# Altium project EP4_ECD_On_Board_Comptuer.PrjPcb (part 1 of 2)
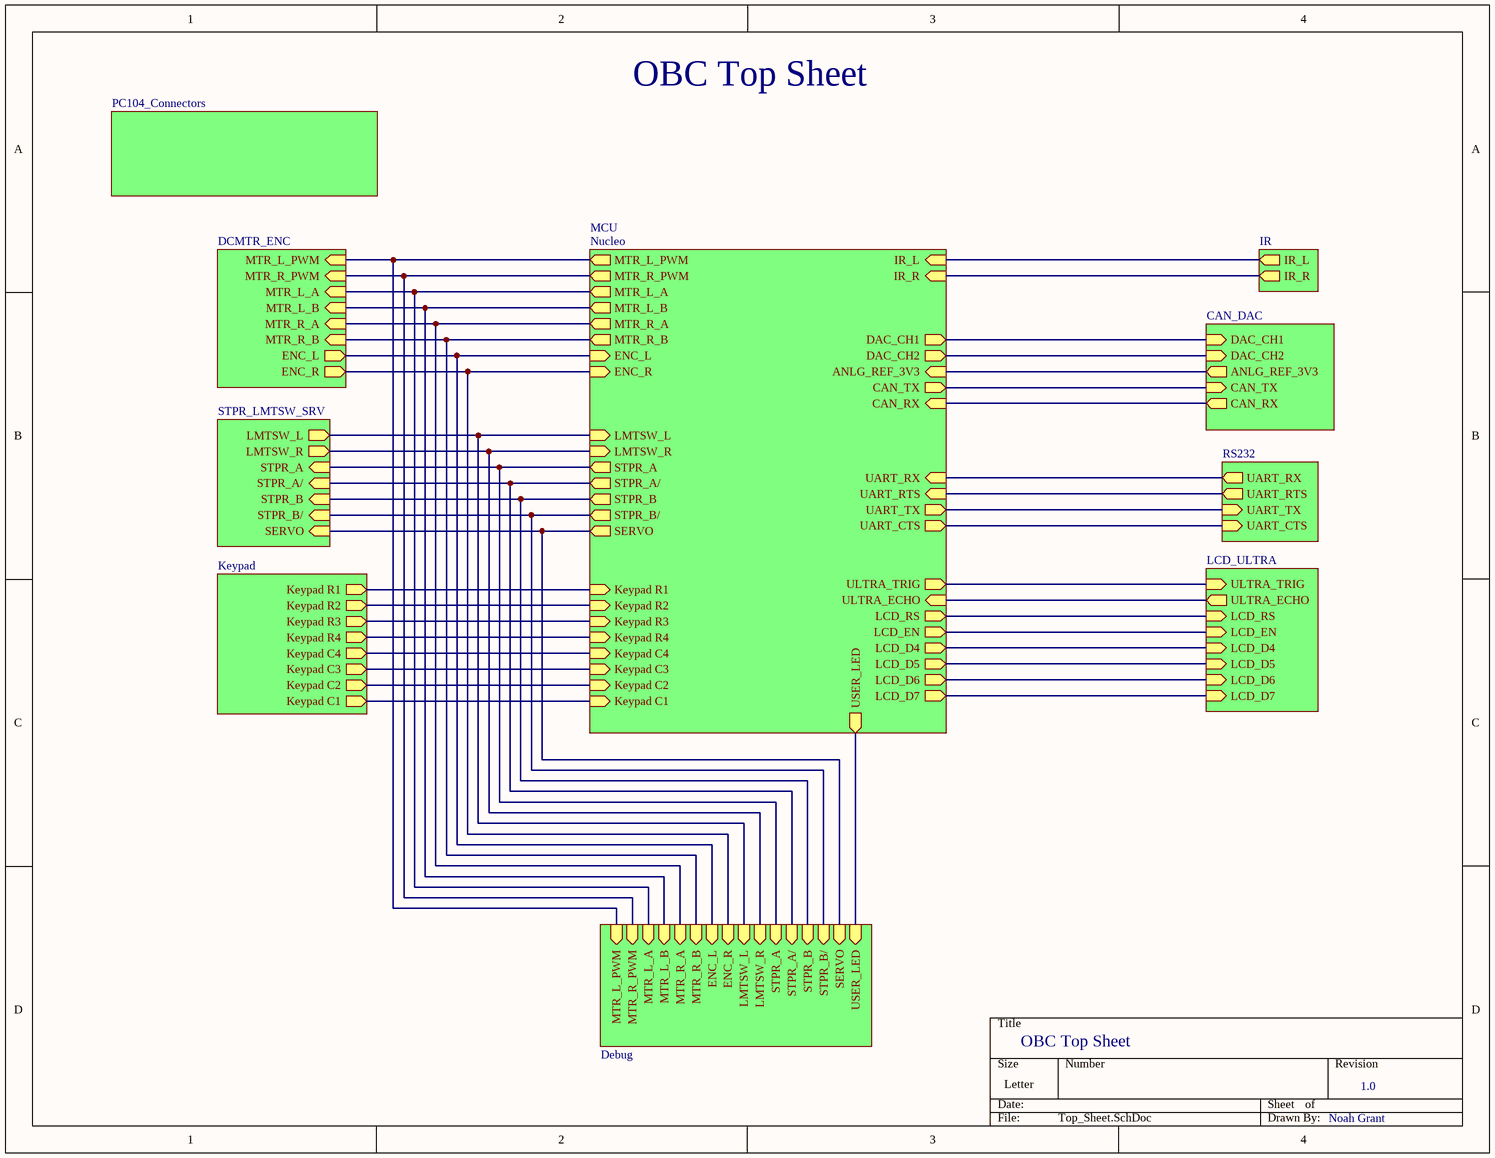
[diagram p0: Top_Sheet.SchDoc]
11 sheets, 91 parts. Net scope: hierarchical (ports join the sheet entries above them; power ports are global).
Board file: OBC.PcbDoc
Sheets:
  Top_Sheet.SchDoc
    MCU = Nucleo.SchDoc
    Designator = DCMTR_ENC.SchDoc
    Designator = STPR_LMTSW_SRV.SchDoc
    Designator = RS232.SchDoc
    Designator = CAN_DAC.SchDoc
    Designator = IR.SchDoc
    Designator = LCD_ULTRA.SchDoc
    Designator = Debug.SchDoc
    Designator = PC104_Connectors.SchDoc
    Designator = Keypad.SchDoc

## Sheet Top_Sheet.SchDoc
size Letter; SheetNumber: 1; SheetTotal: 11

### Sub-sheets
Designator = DCMTR_ENC: MTR_L_PWM (in), MTR_R_PWM (in), MTR_L_A (in), MTR_L_B (in), MTR_R_A (in), MTR_R_B (in), ENC_L (out), ENC_R (out)
Designator = STPR_LMTSW_SRV: LMTSW_L (out), LMTSW_R (out), STPR_A (in), STPR_A/ (in), STPR_B (in), STPR_B/ (in), SERVO (in)
Designator = RS232: UART_RX (out), UART_RTS (out), UART_TX (in), UART_CTS (in)
Designator = CAN_DAC: DAC_CH1 (in), DAC_CH2 (in), ANLG_REF_3V3 (out), CAN_TX (in), CAN_RX (out)
Designator = IR: IR_L (out), IR_R (out)
Designator = LCD_ULTRA: ULTRA_TRIG (in), ULTRA_ECHO (out), LCD_RS (in), LCD_EN (in), LCD_D4 (in), LCD_D5 (in), LCD_D6 (in), LCD_D7 (in)
Designator = Debug: ENC_L (in), ENC_R (in), MTR_L_PWM (in), MTR_R_PWM (in), MTR_L_A (in), MTR_L_B (in), MTR_R_A (in), MTR_R_B (in), STPR_A (in), STPR_A/ (in), STPR_B (in), STPR_B/ (in), SERVO (in), LMTSW_L (in), LMTSW_R (in), USER_LED (in)
Designator = PC104_Connectors: no entries
Designator = Keypad: Keypad R1 (out), Keypad R2 (out), Keypad R3 (out), Keypad R4 (out), Keypad C4 (out), Keypad C3 (out), Keypad C2 (out), Keypad C1 (out)
MCU = Nucleo: MTR_L_PWM (out), MTR_L_A (out), USER_LED (out), MTR_L_B (out), STPR_B (out), STPR_B/ (out), MTR_R_PWM (out), DAC_CH1 (out), STPR_A/ (out), STPR_A (out), MTR_R_B (out), CAN_RX (in), CAN_TX (out), ANLG_REF_3V3 (in), DAC_CH2 (out), LCD_RS (out), LCD_EN (out), ULTRA_ECHO (in), LCD_D5 (out), LCD_D4 (out), UART_TX (out), LCD_D6 (out), MTR_R_A (out), LMTSW_R (in), LMTSW_L (in), ULTRA_TRIG (out), LCD_D7 (out), UART_RX (in), SERVO (out), UART_CTS (out), UART_RTS (in), ENC_L (in), ENC_R (in), Keypad R1 (in), Keypad R2 (in), Keypad R3 (in), Keypad R4 (in), Keypad C4 (in), Keypad C3 (in), Keypad C2 (in), Keypad C1 (in), IR_L (in), IR_R (in)

### Nets
ANLG_REF_3V3: sheet MCU/ANLG_REF_3V3, sheet Designator/ANLG_REF_3V3
CAN_RX: sheet MCU/CAN_RX, sheet Designator/CAN_RX
CAN_TX: sheet MCU/CAN_TX, sheet Designator/CAN_TX
DAC_CH1: sheet MCU/DAC_CH1, sheet Designator/DAC_CH1
DAC_CH2: sheet MCU/DAC_CH2, sheet Designator/DAC_CH2
ENC_L: sheet MCU/ENC_L, sheet Designator/ENC_L, sheet Designator/ENC_L
ENC_R: sheet MCU/ENC_R, sheet Designator/ENC_R, sheet Designator/ENC_R
IR_L: sheet MCU/IR_L, sheet Designator/IR_L
IR_R: sheet MCU/IR_R, sheet Designator/IR_R
Keypad C1: sheet MCU/Keypad C1, sheet Designator/Keypad C1
Keypad C2: sheet MCU/Keypad C2, sheet Designator/Keypad C2
Keypad C3: sheet MCU/Keypad C3, sheet Designator/Keypad C3
Keypad C4: sheet MCU/Keypad C4, sheet Designator/Keypad C4
Keypad R1: sheet MCU/Keypad R1, sheet Designator/Keypad R1
Keypad R2: sheet MCU/Keypad R2, sheet Designator/Keypad R2
Keypad R3: sheet MCU/Keypad R3, sheet Designator/Keypad R3
Keypad R4: sheet MCU/Keypad R4, sheet Designator/Keypad R4
LCD_D4: sheet MCU/LCD_D4, sheet Designator/LCD_D4
LCD_D5: sheet MCU/LCD_D5, sheet Designator/LCD_D5
LCD_D6: sheet MCU/LCD_D6, sheet Designator/LCD_D6
LCD_D7: sheet MCU/LCD_D7, sheet Designator/LCD_D7
LCD_EN: sheet MCU/LCD_EN, sheet Designator/LCD_EN
LCD_RS: sheet MCU/LCD_RS, sheet Designator/LCD_RS
LMTSW_L: sheet MCU/LMTSW_L, sheet Designator/LMTSW_L, sheet Designator/LMTSW_L
LMTSW_R: sheet MCU/LMTSW_R, sheet Designator/LMTSW_R, sheet Designator/LMTSW_R
MTR_L_A: sheet MCU/MTR_L_A, sheet Designator/MTR_L_A, sheet Designator/MTR_L_A
MTR_L_B: sheet MCU/MTR_L_B, sheet Designator/MTR_L_B, sheet Designator/MTR_L_B
MTR_L_PWM: sheet MCU/MTR_L_PWM, sheet Designator/MTR_L_PWM, sheet Designator/MTR_L_PWM
MTR_R_A: sheet MCU/MTR_R_A, sheet Designator/MTR_R_A, sheet Designator/MTR_R_A
MTR_R_B: sheet MCU/MTR_R_B, sheet Designator/MTR_R_B, sheet Designator/MTR_R_B
MTR_R_PWM: sheet MCU/MTR_R_PWM, sheet Designator/MTR_R_PWM, sheet Designator/MTR_R_PWM
SERVO: sheet MCU/SERVO, sheet Designator/SERVO, sheet Designator/SERVO
STPR_A: sheet MCU/STPR_A, sheet Designator/STPR_A, sheet Designator/STPR_A
STPR_A/: sheet MCU/STPR_A/, sheet Designator/STPR_A/, sheet Designator/STPR_A/
STPR_B: sheet MCU/STPR_B, sheet Designator/STPR_B, sheet Designator/STPR_B
STPR_B/: sheet MCU/STPR_B/, sheet Designator/STPR_B/, sheet Designator/STPR_B/
UART_CTS: sheet MCU/UART_CTS, sheet Designator/UART_CTS
UART_RTS: sheet MCU/UART_RTS, sheet Designator/UART_RTS
UART_RX: sheet MCU/UART_RX, sheet Designator/UART_RX
UART_TX: sheet MCU/UART_TX, sheet Designator/UART_TX
ULTRA_ECHO: sheet MCU/ULTRA_ECHO, sheet Designator/ULTRA_ECHO
ULTRA_TRIG: sheet MCU/ULTRA_TRIG, sheet Designator/ULTRA_TRIG
USER_LED: sheet MCU/USER_LED, sheet Designator/USER_LED

### Notes on the sheet
- OBC Top Sheet
- 1.0
- Noah Grant

## Sheet Nucleo.SchDoc
size Letter; SheetNumber: 3; SheetTotal: 11
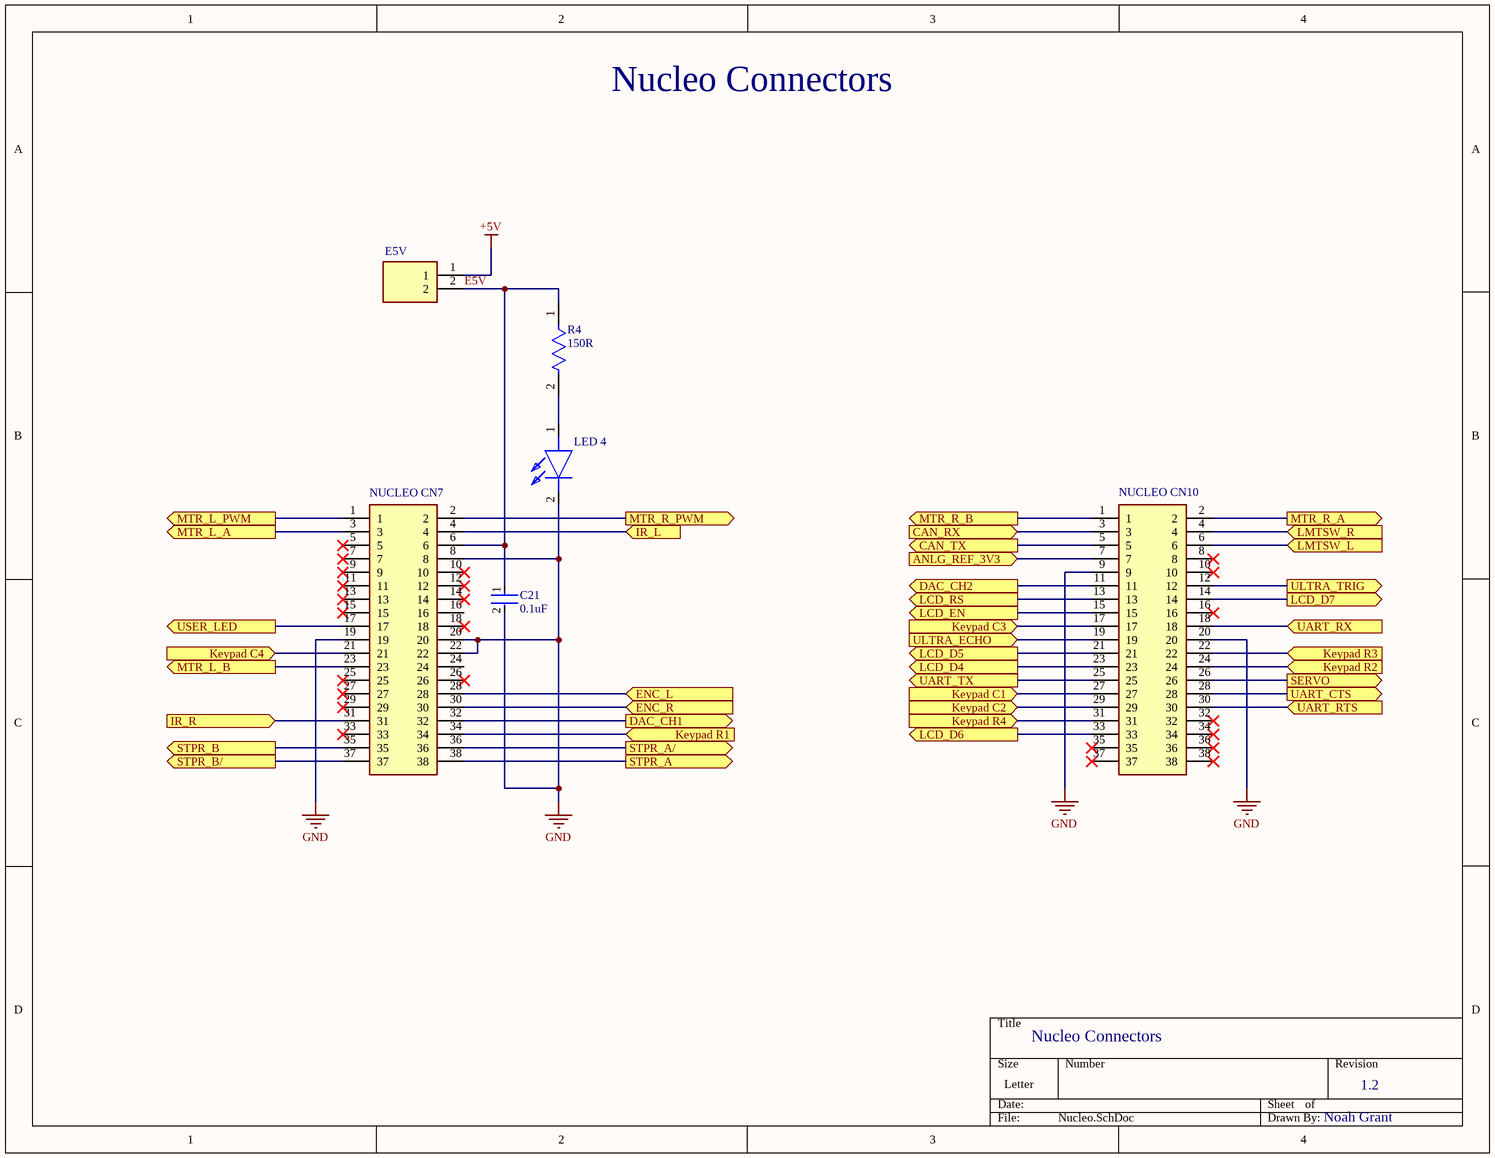
[diagram p1: Nucleo.SchDoc]

### Parts
C21  0.1uF  [FP-CC0603-DA-MFG]
E5V  0022284023  [HDRV2W87P0X254_1X2_508X249X863P]  (value not drawn)
LED_4  APL3015EC-F01  [APL3015ECF01]  (value not drawn)
NUCLEO_CN7  SSW-119-01-G-D-LL  [SSW-119-XX-YYY-D-LL]  (value not drawn)
NUCLEO_CN10  SSW-119-01-G-D-LL  [SSW-119-XX-YYY-D-LL]  (value not drawn)
R4  150R  [FP-MCT0603-IPC_C]

### Ports
ANLG_REF_3V3 (in, see Top_Sheet[3B], CAN_DAC[3D], CAN_DAC[4B]), CAN_RX (in, see Top_Sheet[3B], CAN_DAC[1B]), CAN_TX (out, see Top_Sheet[3B], CAN_DAC[1B]), DAC_CH1 (out, see Top_Sheet[3B], CAN_DAC[3B]), DAC_CH2 (out, see Top_Sheet[3B], CAN_DAC[3B]), ENC_L (in, see Top_Sheet[2B], DCMTR_ENC[2B], Debug[1B]), ENC_R (in, see Top_Sheet[2B], DCMTR_ENC[1B], Debug[1B]), IR_L (in, see Top_Sheet[3A], IR[2C]), IR_R (in, see Top_Sheet[3A], IR[4C]), Keypad C1 (in, see Top_Sheet[2C], Keypad[3B]), Keypad C2 (in, see Top_Sheet[2C], Keypad[3B]), Keypad C3 (in, see Top_Sheet[2C], Keypad[3B]), Keypad C4 (in, see Top_Sheet[2C], Keypad[3B]), Keypad R1 (in, see Top_Sheet[2C], Keypad[3C]), Keypad R2 (in, see Top_Sheet[2C], Keypad[3C]), Keypad R3 (in, see Top_Sheet[2C], Keypad[3B]), Keypad R4 (in, see Top_Sheet[2C], Keypad[3B]), LCD_D4 (out, see Top_Sheet[3C], LCD_ULTRA[1C]), LCD_D5 (out, see Top_Sheet[3C], LCD_ULTRA[1C]), LCD_D6 (out, see Top_Sheet[3C], LCD_ULTRA[1C]), LCD_D7 (out, see Top_Sheet[3C], LCD_ULTRA[1C]), LCD_EN (out, see Top_Sheet[3C], LCD_ULTRA[1B]), LCD_RS (out, see Top_Sheet[3C], LCD_ULTRA[1B]), LMTSW_L (in, see Top_Sheet[2B], Debug[3B], STPR_LMTSW_SRV[2C]), LMTSW_R (in, see Top_Sheet[2B], Debug[3B], STPR_LMTSW_SRV[2D]), MTR_L_A (out, see Top_Sheet[2A], DCMTR_ENC[3C], Debug[1B]), MTR_L_B (out, see Top_Sheet[2B], DCMTR_ENC[3C], Debug[1B]), MTR_L_PWM (out, see Top_Sheet[2A], DCMTR_ENC[3C], Debug[1B]), MTR_R_A (out, see Top_Sheet[2B], DCMTR_ENC[3C], Debug[1B]), MTR_R_B (out, see Top_Sheet[2B], DCMTR_ENC[3C], Debug[1B]), MTR_R_PWM (out, see Top_Sheet[2A], DCMTR_ENC[3C], Debug[1B]), SERVO (out, see Top_Sheet[2B], Debug[3B], STPR_LMTSW_SRV[3C]), STPR_A (out, see Top_Sheet[2B], Debug[3B], STPR_LMTSW_SRV[1B]), STPR_A/ (out, see Top_Sheet[2B], Debug[3B], STPR_LMTSW_SRV[1B]), STPR_B (out, see Top_Sheet[2B], Debug[3B], STPR_LMTSW_SRV[1B]), STPR_B/ (out, see Top_Sheet[2B], Debug[3B], STPR_LMTSW_SRV[1B]), UART_CTS (out, see Top_Sheet[3B], RS232[1B]), UART_RTS (in, see Top_Sheet[3B], RS232[3B]), UART_RX (in, see Top_Sheet[3B], RS232[3B]), UART_TX (out, see Top_Sheet[3B], RS232[1B]), ULTRA_ECHO (in, see Top_Sheet[3C], LCD_ULTRA[4B]), ULTRA_TRIG (out, see Top_Sheet[3C], LCD_ULTRA[3B]), USER_LED (out, see Top_Sheet[3C], Debug[1C])

### Nets
+5V: E5V.1
GND: C21.2 LED_4.2(K) NUCLEO_CN7.8 NUCLEO_CN7.19 NUCLEO_CN7.20 NUCLEO_CN7.22 NUCLEO_CN10.9 NUCLEO_CN10.20
ANLG_REF_3V3: NUCLEO_CN10.7 ; port ANLG_REF_3V3
CAN_RX: NUCLEO_CN10.3 ; port CAN_RX
CAN_TX: NUCLEO_CN10.5 ; port CAN_TX
DAC_CH1: NUCLEO_CN7.32 ; port DAC_CH1
DAC_CH2: NUCLEO_CN10.11 ; port DAC_CH2
E5V: C21.1 E5V.2 NUCLEO_CN7.6 R4.1
ENC_L: NUCLEO_CN7.28 ; port ENC_L
ENC_R: NUCLEO_CN7.30 ; port ENC_R
IR_L: NUCLEO_CN7.4 ; port IR_L
IR_R: NUCLEO_CN7.31 ; port IR_R
Keypad C1: NUCLEO_CN10.27 ; port Keypad C1
Keypad C2: NUCLEO_CN10.29 ; port Keypad C2
Keypad C3: NUCLEO_CN10.17 ; port Keypad C3
Keypad C4: NUCLEO_CN7.21 ; port Keypad C4
Keypad R1: NUCLEO_CN7.34 ; port Keypad R1
Keypad R2: NUCLEO_CN10.24 ; port Keypad R2
Keypad R3: NUCLEO_CN10.22 ; port Keypad R3
Keypad R4: NUCLEO_CN10.31 ; port Keypad R4
LCD_D4: NUCLEO_CN10.23 ; port LCD_D4
LCD_D5: NUCLEO_CN10.21 ; port LCD_D5
LCD_D6: NUCLEO_CN10.33 ; port LCD_D6
LCD_D7: NUCLEO_CN10.14 ; port LCD_D7
LCD_EN: NUCLEO_CN10.15 ; port LCD_EN
LCD_RS: NUCLEO_CN10.13 ; port LCD_RS
LMTSW_L: NUCLEO_CN10.6 ; port LMTSW_L
LMTSW_R: NUCLEO_CN10.4 ; port LMTSW_R
MTR_L_A: NUCLEO_CN7.3 ; port MTR_L_A
MTR_L_B: NUCLEO_CN7.23 ; port MTR_L_B
MTR_L_PWM: NUCLEO_CN7.1 ; port MTR_L_PWM
MTR_R_A: NUCLEO_CN10.2 ; port MTR_R_A
MTR_R_B: NUCLEO_CN10.1 ; port MTR_R_B
MTR_R_PWM: NUCLEO_CN7.2 ; port MTR_R_PWM
SERVO: NUCLEO_CN10.26 ; port SERVO
STPR_A: NUCLEO_CN7.38 ; port STPR_A
STPR_A/: NUCLEO_CN7.36 ; port STPR_A/
STPR_B: NUCLEO_CN7.35 ; port STPR_B
STPR_B/: NUCLEO_CN7.37 ; port STPR_B/
UART_CTS: NUCLEO_CN10.28 ; port UART_CTS
UART_RTS: NUCLEO_CN10.30 ; port UART_RTS
UART_RX: NUCLEO_CN10.18 ; port UART_RX
UART_TX: NUCLEO_CN10.25 ; port UART_TX
ULTRA_ECHO: NUCLEO_CN10.19 ; port ULTRA_ECHO
ULTRA_TRIG: NUCLEO_CN10.12 ; port ULTRA_TRIG
USER_LED: NUCLEO_CN7.17 ; port USER_LED
NetLED_4_1: LED_4.1(A) R4.2

Not connected (* = marked no-connect by the designer): NUCLEO_CN7 5* 7* 9* 10* 11* 12* 13* 14* 15* 16 18* 24 25* 26* 27* 29* 33*; NUCLEO_CN10 8* 10* 16* 32* 34* 35* 36* 37* 38*

### Notes on the sheet
- Nucleo Connectors
- 1.2
- Noah Grant

### Library data of the parts
C21 = CMP-03422-000468-1: CAP CER 0.1UF 50V X7R 0603; Manufacturer: YAGEO; Manufacturer Part Number: CC0603KPX7R9BB104; Temperature Coefficient: 15%; Capacitance: 100 nF; Material: Ceramic; Value: 100 nF; Tolerance: 0.1; Device Class L1: Passive Components; Temperature Range High: +125°C; ComponentLink2Description: Datasheet; Temperature Characteristic: X7R; Octopart: https://octopart.com/cc0603kpx7r9bb104-yageo-12885113; Height: 0.9mm; Mouser Description: Multilayer Ceramic Capacitors MLCC - SMD/SMT 100nF 50V X7R 10%; Device Class L3: Ceramic Capacitors; Voltage Rating: 50 V; Device Class L2: Capacitors; ComponentLink2URL: http://www.yageo.com/documents/recent/UPY-GPHC_X7R_6.3V-to-50V_18.pdf; Package: CC0603-DA; Automotive: No; Voltage: 50 V; RoHS: TRUE; Lead Free: Yes; Digikey Description: CAP CER 0.1UF 50V X7R 0603; Footprint Url: http://www.yageo.com/exep/pages/download/literatures/UPY-C_GEN_24.pdf; Temperature Range Low: -55°C; Temperature: -55°C to +125°C; Category: Cap
E5V = 0022284023: Connector; Manufacturer_Name: Molex; Datasheet Link: https://www.molex.com/pdm_docs/sd/022284023_sd.pdf; Height: 8.63mm; Manufacturer_Part_Number: 0022284023; Mouser Part Number: N/A; Mouser Price/Stock: https://www.mouser.co.uk/ProductDetail/Molex/0022284023?qs=PBcRNPEHKsr%2FPE%2F%252B8ije0g%3D%3D; Arrow Part Number: 0022284023; Arrow Price/Stock: https://www.arrow.com/en/products/0022284023/molex
LED_4 = APL3015EC-F01: LED; Manufacturer_Name: Kingbright; Datasheet Link: https://componentsearchengine.com/Datasheets/1/APL3015EC-F01.pdf; Manufacturer_Part_Number: APL3015EC-F01; Mouser Part Number: 604-APL3015EC-F01; Mouser Price/Stock: https://www.mouser.co.uk/ProductDetail/Kingbright/APL3015EC-F01?qs=VdjlWU%2FzoOF91deOgS6C3g%3D%3D
NUCLEO_CN7 NUCLEO_CN10 = SSW-119-01-G-D-LL: Connector; Manufacturer_Name: SAMTEC; Datasheet Link: http://suddendocs.samtec.com/prints/ssw-1xx-xx-xxx-x-xx-xxx-xx-mkt.pdf; Manufacturer_Part_Number: SSW-119-01-G-D-LL
R4 = CMP-02407-011712-1: RES SMD 100 OHM 1% 1/8W 0603; Power Rating: 125mW; Tolerance: 0.5%; Voltage Rating: 75V; Max Power Dissipation: 150mW; Temperature Coefficient: 25ppm/°C; Resistance: 150R; Packaging: Tape and Reel; Termination: SMD/SMT; Construction: Rectangular; Max Operating Temperature: 175°C; Length: 0.061inch; Case/Package: 0603; Depth: 0.85mm; Military Standard: Not; Case Code (Metric): 1608; Package Quantity: 1; Width: 0.8mm; Features: Automotive AEC-Q200; Height: 0.022inch; REACH SVHC: No SVHC; Min Operating Temperature: -55°C; Resistor Type: Thin Film; RoHS Compliant: Yes; Resistance Tolerance: 0.5%; Series: MCT 0603 - Professional; Voltage Rating (DC): 75V; Number of Terminations: 2; Case Code (Imperial): 0603; Number of Pins: 2

## Sheet DCMTR_ENC.SchDoc
size Letter; SheetNumber: 4; SheetTotal: 11; SPICEModelCacheWFUJGXDS: <root> / <DocumentId>WFUJGXDS</DocumentId> / </root>
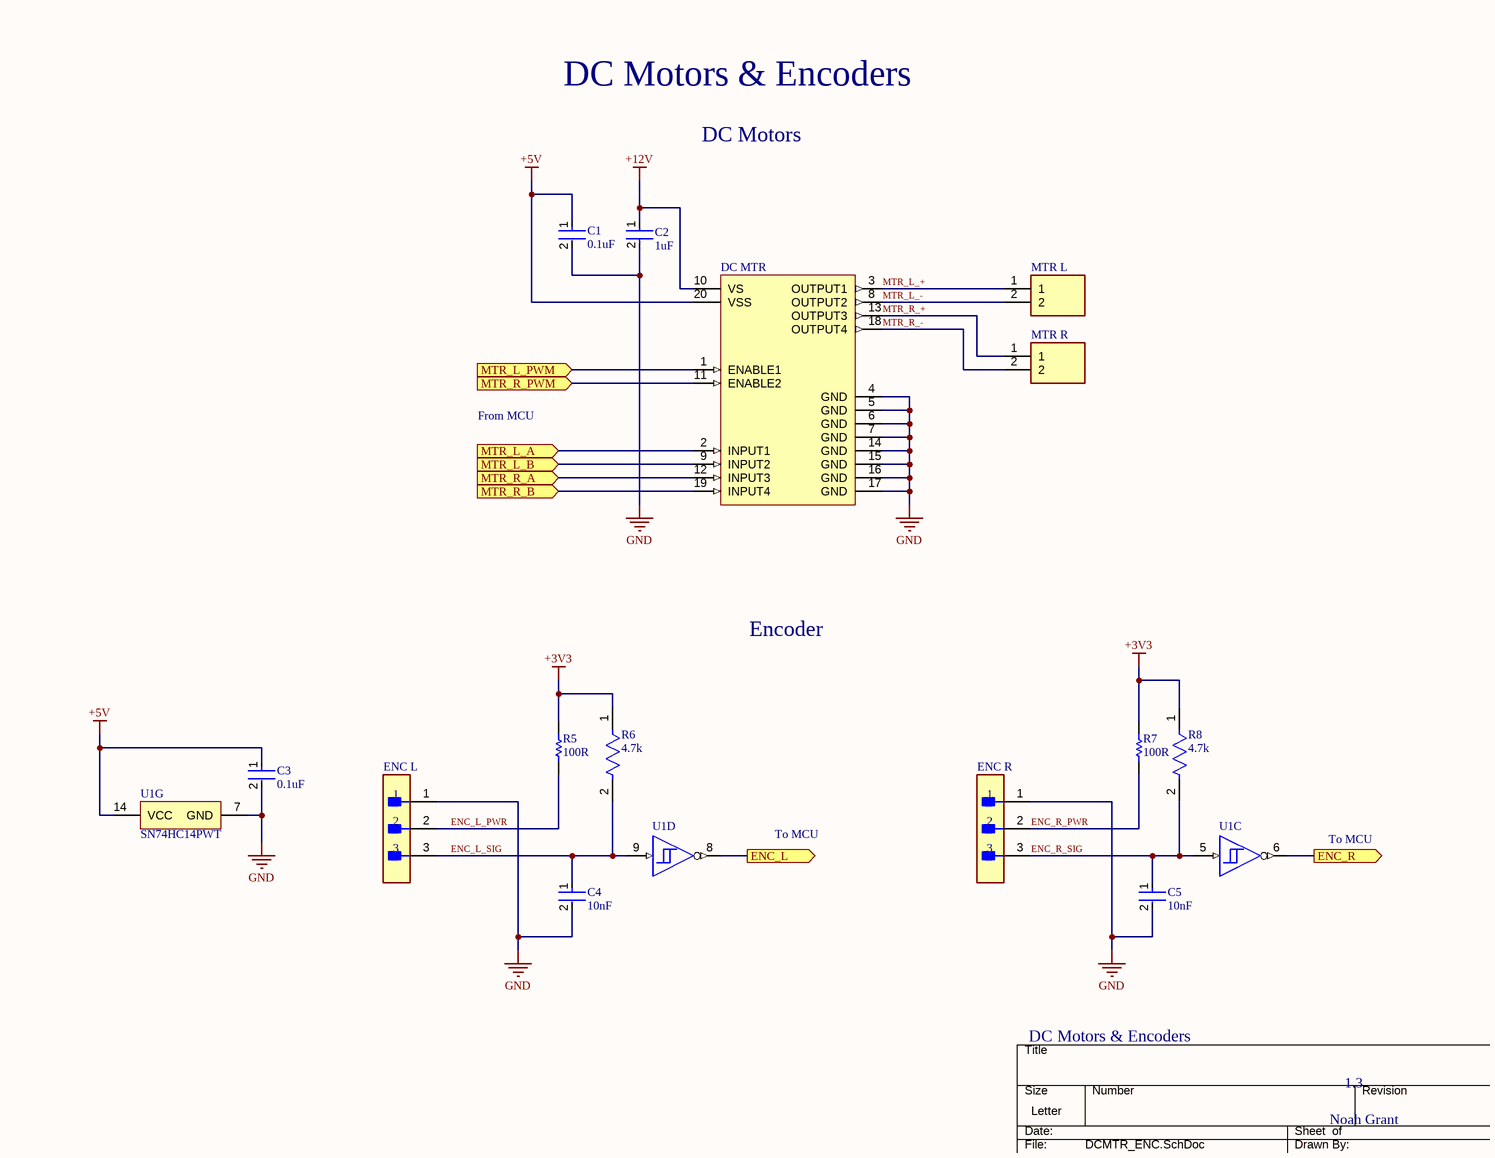
[diagram p2: DCMTR_ENC.SchDoc]

### Parts
C1  0.1uF  [FP-CC0603-DA-MFG]
C2  1uF  [FP-C1608-080-0_1-MFG]
C3  0.1uF  [FP-CC0603-DA-MFG]
C4  10nF  [FP-CC0603-DA-MFG]
C5  10nF  [FP-CC0603-DA-MFG]
DC_MTR  L293DD  [STM-SOIC-20_M]  (value not drawn)
ENC_L  22-11-2032  [FP-22-11-2032-MFG]  (value not drawn)
ENC_R  22-11-2032  [FP-22-11-2032-MFG]  (value not drawn)
MTR_L  22-11-2022  [HDRV2W75P0X254_1X2_493X635X1091P]  (value not drawn)
MTR_R  22-11-2022  [HDRV2W75P0X254_1X2_493X635X1091P]  (value not drawn)
R5  100R  [RESC1609X50X30ML8T20]
R6  4.7k  [FP-CRCW0603-e3-IPC_A]
R7  100R  [RESC1609X50X30ML8T20]
R8  4.7k  [FP-CRCW0603-e3-IPC_A]
U1  SN74HC14PWT  [PW0014A_M]  (value not drawn)  (parts C,D,G of 7)

### Ports
ENC_L (out, see Top_Sheet[1B], Debug[1B], Nucleo[2C]), ENC_R (out, see Top_Sheet[1B], Debug[1B], Nucleo[2C]), MTR_L_A (in, see Top_Sheet[1A], Debug[1B], Nucleo[1B]), MTR_L_B (in, see Top_Sheet[1B], Debug[1B], Nucleo[1C]), MTR_L_PWM (in, see Top_Sheet[1A], Debug[1B], Nucleo[1B]), MTR_R_A (in, see Top_Sheet[1B], Debug[1B], Nucleo[4B]), MTR_R_B (in, see Top_Sheet[1B], Debug[1B], Nucleo[3B]), MTR_R_PWM (in, see Top_Sheet[1A], Debug[1B], Nucleo[2B])

### Nets
+3V3: R5.2 R6.1 R7.2 R8.1
+5V: C1.1 C3.1 DC_MTR.20(VSS) U1.14(VCC)
+12V: C2.1 DC_MTR.10(VS)
GND: C1.2 C2.2 C3.2 C4.2 C5.2 DC_MTR.4(GND) DC_MTR.5(GND) DC_MTR.6(GND) DC_MTR.7(GND) DC_MTR.14(GND) DC_MTR.15(GND) DC_MTR.16(GND) DC_MTR.17(GND) ENC_L.1 ENC_R.1 U1.7(GND)
ENC_L: U1.8(~{4Y}) ; port ENC_L
ENC_L_PWR: ENC_L.2 R5.1
ENC_L_SIG: C4.1 ENC_L.3 R6.2 U1.9(4A)
ENC_R: U1.6(~{3Y}) ; port ENC_R
ENC_R_PWR: ENC_R.2 R7.1
ENC_R_SIG: C5.1 ENC_R.3 R8.2 U1.5(3A)
MTR_L_+: DC_MTR.3(OUTPUT1) MTR_L.1
MTR_L_-: DC_MTR.8(OUTPUT2) MTR_L.2
MTR_L_A: DC_MTR.2(INPUT1) ; port MTR_L_A
MTR_L_B: DC_MTR.9(INPUT2) ; port MTR_L_B
MTR_L_PWM: DC_MTR.1(ENABLE1) ; port MTR_L_PWM
MTR_R_+: DC_MTR.13(OUTPUT3) MTR_R.1
MTR_R_-: DC_MTR.18(OUTPUT4) MTR_R.2
MTR_R_A: DC_MTR.12(INPUT3) ; port MTR_R_A
MTR_R_B: DC_MTR.19(INPUT4) ; port MTR_R_B
MTR_R_PWM: DC_MTR.11(ENABLE2) ; port MTR_R_PWM

### Notes on the sheet
- DC Motors & Encoders
- DC Motors
- From MCU
- Encoder
- To MCU
- 1.3
- Noah Grant
- DWG. NO.
- REV.
- SHT.
- THIS DOCUMENT AND THE DATA DISCLOSED HEREIN OR HEREWITH IS THE PROPERTY OF ALTIUM LIMITED AND MAY BE FREELY DISTRIBUTED IN WHOLE. NO RIGHTS ARE RESERVED OR EXPRESS OR IMPLIED WARANTEE GIVEN.
- REVISION
- DESCRIPTION
- DATE
- APPROVED
- ENG:
- APPROVALS
- PROJECT
- DSN:
- CHK:
- REFERENCE DOCUMENTS
- PROJECT REVISION:
- TITLE
- DOCUMENT REVISION:
- DESIGN ITEM:
- BOM:
- FAB DWG:
- PCB DWG:
- ASSY DWG:
- SCALE:
- SIZE
- B
- CAGE CODE
- FILE NAME
- DWG NO.
- SHEET
- OF
- REV

### Library data of the parts
C1 C3 = CMP-03422-000468-1: as C21 on sheet Nucleo; Device Class L1: Passive Components; Temperature Range High: +125°C; ComponentLink2Description: Datasheet; Temperature Characteristic: X7R; Octopart: https://octopart.com/cc0603kpx7r9bb104-yageo-12885113; Height: 0.9mm; Mouser Description: Multilayer Ceramic Capacitors MLCC - SMD/SMT 100nF 50V X7R 10%; Device Class L3: Ceramic Capacitors; Voltage Rating: 50 V; Device Class L2: Capacitors; ComponentLink2URL: http://www.yageo.com/documents/recent/UPY-GPHC_X7R_6.3V-to-50V_18.pdf; Package: CC0603-DA; Automotive: No; Voltage: 50 V; RoHS: TRUE; Lead Free: Yes; Digikey Description: CAP CER 0.1UF 50V X7R 0603; Footprint Url: http://www.yageo.com/exep/pages/download/literatures/UPY-C_GEN_24.pdf; Temperature Range Low: -55°C; Temperature: -55°C to +125°C; Category: Cap
C2 = CMP-08246-006763-1: Multilayer Ceramic Capacitors 1μF ±10% 25V X6S SMD 0603; Dielectric: X6S; Capacitance: 1uF; Construction: Flat; Case/Package: 0603; Tolerance: 10%; Dielectric Material: Ceramic; Lead Free: Lead Free; Series: C; Case Code (Metric): 1608; Width: 0.031inch; Weight: 7.1E-05oz; Voltage Rating: 25V; Depth: 0.8mm; Packaging: Tape and Reel; Termination: SMD/SMT; Voltage Rating (DC): 25V; Mount: Surface Mount; Height: 0.8mm; Max Operating Temperature: 105°C; Min Operating Temperature: -55°C; Case Code (Imperial): 0603; Package Quantity: 4000; Length: 1.6mm; Thickness: 0.035inch; RoHS Compliant: Yes
C4 C5 = CMP-2100-03600-2: CAP CER 10000PF 50V X7R 0603; Manufacturer Part Number: CC0603KRX7R9BB103; Manufacturer: YAGEO; Tolerance: 0.1; Material: Ceramic; Temperature Coefficient: 15%; Mouser Description: Multilayer Ceramic Capacitor, CC Series, 0.01 - F, - 10%, X7R, 50 V, 0603 [1608 Metric]; Digikey Description: CAP CER 10000PF 50V X7R 0603; Height: 0.9mm; Category: Cap; Temperature Characteristic: X7R; Footprint Url: http://www.yageo.com/exep/pages/download/literatures/UPY-C_GEN_24.pdf; Lead Free: Yes; Voltage Rating: 50 V; Temperature: -55°C to +125°C; Device Class L3: Ceramic Capacitors; ComponentLink2Description: Datasheet; Voltage: 50 V; Package: CC0603-DA; Octopart: https://octopart.com/cc0603krx7r9bb103-yageo-192938; Automotive: No; Temperature Range High: +125°C; Temperature Range Low: -55°C; Value: 10 nF; RoHS: TRUE; Device Class L1: Passive Components; ComponentLink2URL: http://www.yageo.com/documents/recent/UPY-GPHC_X7R_6.3V-to-50V_18.pdf; Device Class L2: Capacitors; Capacitance: 10 nF
DC_MTR = CMP-1771-00003-1: Push-Pull Four Channel Driver with Diodes, 4.5 to 36 V, 20-Pin SOIC, RoHS, Tube; Voltage Rating: 50 V; Power Rating: 100 mW; Case\Package: 0603; Resistance: 15 kohm; Tolerance: 1%; REACH SVHC: Unknown; Case Code (Imperial): 0603; ComponentLink2Description: Datasheet; ComponentLink2URL: http://www.st.com/content/ccc/resource/technical/document/datasheet/04/ac/22/f9/20/5d/43/a1/CD00000059.pdf/files/CD00000059.pdf/jcr:content/translations/en.CD00000059.pdf; Max Operating Temperature: 155 degC; Width: 0.8 mm; ComponentLink1URL: http://www.st.com/; ComponentLink1Description: Manufacturer URL; Length: 1.6 mm; Package Quantity: 5000; RoHSCompliant: true; Height: 0.45 mm; Mount: Surface Mount; PackageDescription: 20-Pin Small Outline Integrated Circuit, Body 12.8 x 7.5 mm, Pitch 1.27 mm; PackageReference: SOIC-20; Packaging: Tape and Reel; Min Operating Temperature: -55 degC; Case Code (Metric): 1608; DatasheetVersion: Jul-03
ENC_L ENC_R = CMP-04776-000113-1: CONN HEADER VERT 3POS 2.54MM; Manufacturer: Molex; Number Of Contacts: 3; Voltage Rating: 500V; Conn Gender: Male; Current Rating: 4A; Conn Orientation: Vertical; Device Class L2: Headers and Wire Housings; Number Of Rows: 1; Temperature Range High: +80°C; RoHS: TRUE; ComponentLink2URL: https://www.molex.com/webdocs/datasheets/pdf/en-us/0022112032_PCB_HEADERS.pdf; Manufacturer Part Number: 22-11-2032; Device Class L3: unset; Automotive: No; Temperature: -40°C to +80°C; Temperature Range Low: -40°C; Lead Free: Yes; Pitch: 2.54mm; Footprint Url: https://www.molex.com/pdm_docs/sd/022112032_sd.pdf; Digikey Description: CONN HEADER VERT 3POS 2.54MM; Contact Material: Gold,Nickel; Octopart: https://octopart.com/22-11-2032-molex-10085; Height: 10.91mm; Mouser Description: KK® 254 Solid Header, Vertical, with Friction Lock, 3 Circuits, Gold (Au) Plating; Package: 22-11-2032; Device Class L1: Connectors; Mounting Type: Through Hole; ComponentLink2Description: Datasheet; Category: Conn
MTR_L MTR_R = 22-11-2022: Connector; Manufacturer_Name: Molex; Datasheet Link: https://www.molex.com/pdm_docs/sd/022112022_sd.pdf; Height: 10.91mm; Manufacturer_Part_Number: 22-11-2022
R5 R7 = CMP-2000-03824-5: Chip Resistor, 100 Ohm, +/- 1%, 100 mW,-55 to 155 degC, 0603 (1608 Metric), RoHS, Tape and Ree; Manufacturer: Vishay Semiconductor; ComponentLink2URL: http://www.vishay.com/docs/20035/dcrcwe3.pdf; ComponentLink1URL: http://www.vishay.com/; Mounting Technology: Surface Mount; ComponentLink1Description: Manufacturer URL; ComponentLink2Description: Datasheet; PackageDescription: 2-Pin Surface Mount Device, Body 1.575 x 0.85 mm; PackageReference: 0603; DatasheetVersion: 06/2012
R6 R8 = CMP-1666-00019-3: RES Thick Film, 4.7kΩ, 1%, 0.1W, 100ppm/°C, 0603; Resistance: 4.7kR; Voltage Rating: 75V; Power Rating: 100mW; Case Code (Metric): 1608; Military Standard: Not; Packaging: Tape and Reel; Termination: SMD/SMT; Temperature Coefficient: 100ppm/°C; Lead Free: Lead Free; Length: 1.55mm; Width: 0.85mm; Height: 0.45mm; Depth: 0.85mm; Weight: 7.1E-05oz; Case Code (Imperial): 0603; Contact Plating: Tin; Case/Package: 0603; Max Operating Temperature: 155°C; Mount: Surface Mount; Tolerance: 1%; Min Operating Temperature: -55°C; Package Quantity: 5000; Voltage Rating (DC): 75V; Composition: Thick Film
U1 = CMP-1615-00108-4: Hex Schmitt-Trigger Inverters, PW0014A, SMALL T&R; Manufacturer: Texas Instruments; F @ Nom Voltage(Max)(Mhz): 20; Input Type: CMOS; VCC(Min)(V): 2; Bits(#): 6; Output Drive (IOL/IOH)(Max)(mA): -4/4; Technology Family: HC; Rating: Catalog; Voltage(Nom)(V): 5; ICC @ Nom Voltage(Max)(mA): 0.02; Schmitt Trigger: Yes; tpd @ Nom Voltage(Max)(ns): 31; Operating Temperature Range(C): -40 to 85; Output Type: CMOS; DatasheetVersion: SCLS085G; Generic Part Number: SN74HC14; VCC(Max)(V): 6; Code_JEDEC: MO-153; PackageReference: PW0014A

## Sheet STPR_LMTSW_SRV.SchDoc
size Letter; SheetNumber: 5; SheetTotal: 11; SPICEModelCacheESSCVQFR: <root> / <DocumentId>ESSCVQFR</DocumentId> / <CacheFrame Number="0"> / <Model Name="umk107bj105_a-t" Kind="CKT"> / <Text>* UMK107BJ105_A-T     SPICE MODEL  ( General Type ) / *-------------------------------------------------------------------------------------------------------- / * Model Generated by TAIYO YUDEN Corporation (http://www.ty-top.com) / * Version 1.0 / * TAIYO YUDEN Control No. 170508_130520 / * Copyright(c) 2012 TAIYO YUDEN CO.,LTD. All Rights Reserved. / *-------------------------------------------------------------------------------------------------------- / * / * Products Name : Multilayer Ceramic Capacitors / * / * Characteristics : / *     Capacitance : 1 uF , Rated Voltage : 50V , TCC : X5R / *     Case Size : 1.6 x 0.8 / 0.063 x 0.031 [mm/inch] , Thickness : 0.8 / 0.031 [mm/inch] / *     (Conditions: Temperature = 25 degC , DC Bias Current/Voltage = 0A / 0V) / * / * Frequency Range : 40Hz - 3GHz / * / * External Node Assignments : / * / *  1  o---| |---o  2 / * / *-------------------------------------------------------------------------------------------------------- / .SubCkt UMK107BJ105_A-T 1 2 / **************************** / C0 1 110 0.79929u / Cm 1 101 0.13681u / C1 101 102 0.26224u / Rc1 101 102 5.8806k / C2 102 103 0.057839u / Rc2 102 103 469.42 / C3 103 110 0.014568u / Rc3 103 110 14.853 / C2m 1 301 0.13283u / C21 301 302 1.2593u / Rc21 301 302 6.3079k / C22 302 303 1.1189u / Rc22 302 303 6.9405k / C23 303 304 1.1421u / Rc23 303 304 6.4848k / C24 304 305 0.36861u / Rc24 304 305 785 / C25 305 306 0.39327u / Rc25 305 306 637.41 / C26 306 307 0.27451u / Rc26 306 307 19.365 / C27 307 308 0.15295u / Rc27 307 308 23.239 / C28 308 309 0.17569u / Rc28 308 309 17.788 / C29 309 110 1420.6p / Rc29 309 110 1.9725 / Rp0 1 110 500Meg / L0 110 120 0.24088n / Lm 120 130 0.1369n / L1 120 121 0.1842n / RL1 121 130 0.29804 / L2 120 122 0.40657n / RL2 122 130 0.57395 / L3 120 123 0.85773n / RL3 123 130 0.82282 / CR 120 124 0.11463u / LR 124 125 0.25983n / RR 125 130 52.447m / CL 130 140 1.4637p / LL 130 140 0.23986n / RL 130 140 33.985 / Rs 140 2 6.8539m / **************************** / .ends UMK107BJ105_A-T</Text> / </Model> / </CacheFrame> / </root>
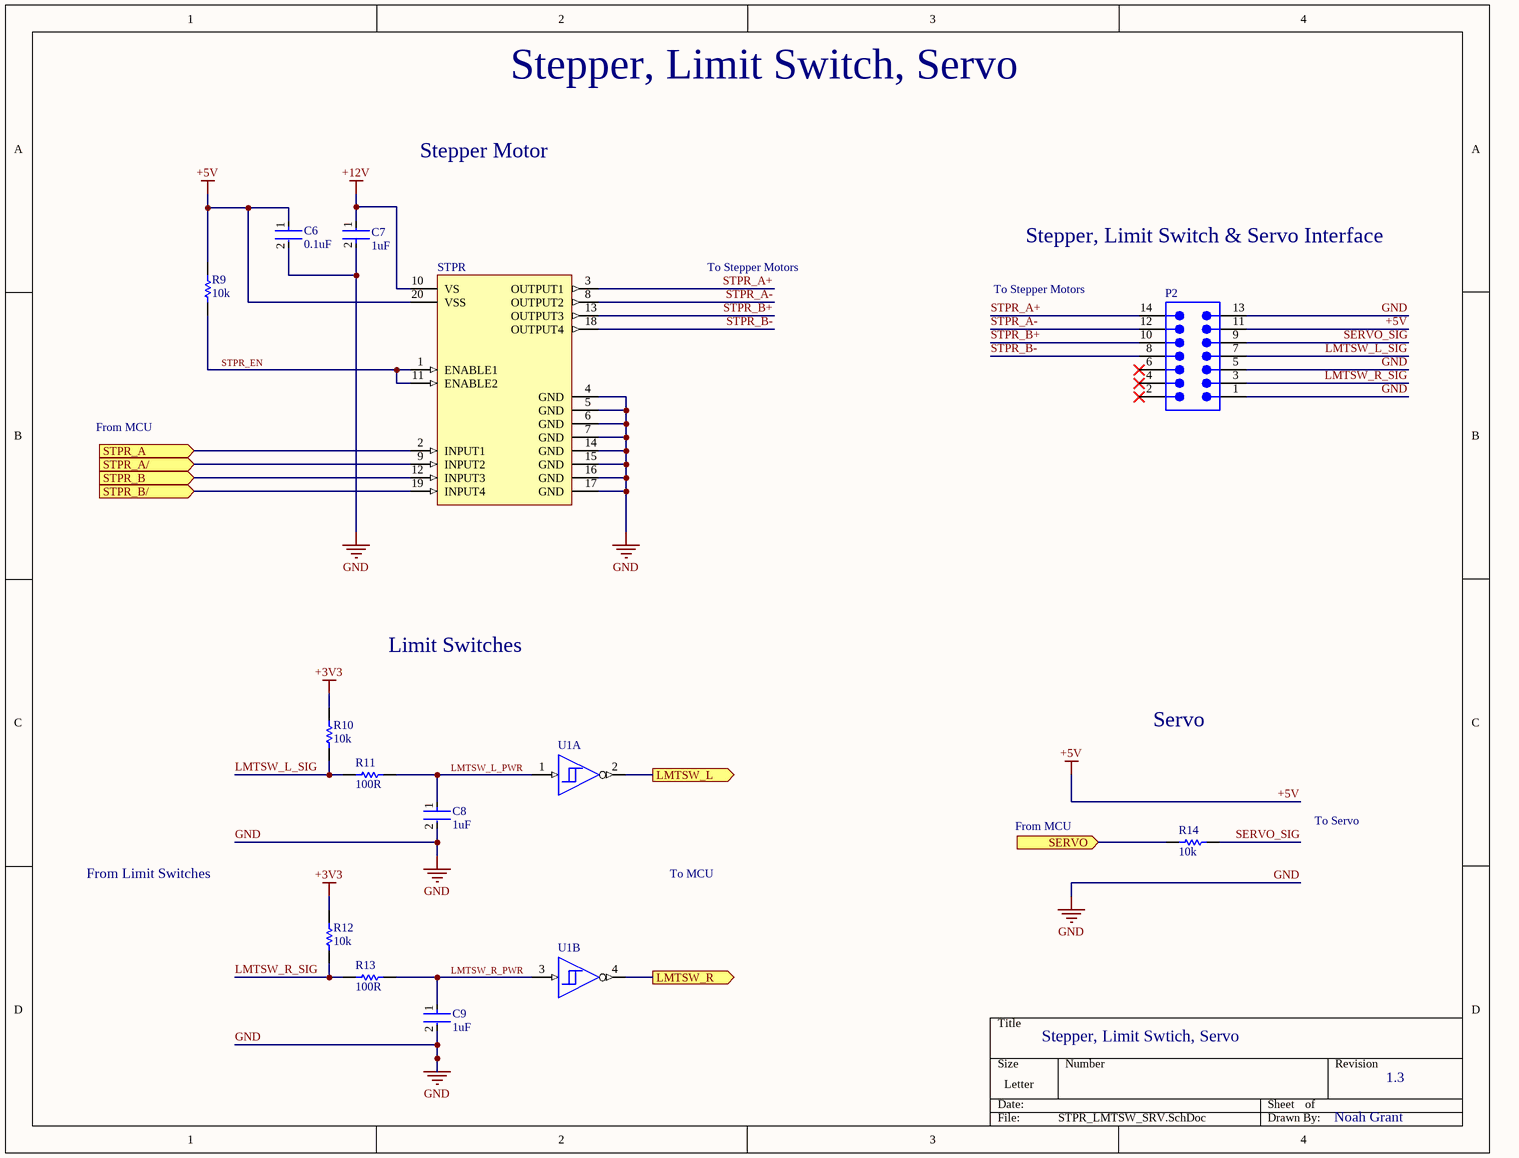
[diagram p3: STPR_LMTSW_SRV.SchDoc]

### Parts
C6  0.1uF  [FP-CC0603-DA-MFG]
C7  1uF  [FP-C1608-080-0_1-MFG]
C8  1uF  [FP-0603-L_1_6_0_1-W_0_8_0-IPC_A]
C9  1uF  [FP-0603-L_1_6_0_1-W_0_8_0-IPC_A]
P2  TSW-107-06-L-D  [SMTC-TSW-107-06-X-D]  (value not drawn)
R9  10k  [RESC1609X50X30NL8T20]
R10  10k  [RESC1609X50X30NL8T20]
R11  100R  [RESC1609X50X30ML8T20]
R12  10k  [RESC1609X50X30NL8T20]
R13  100R  [RESC1609X50X30ML8T20]
R14  10k  [RESC1609X50X30NL8T20]
STPR  L293DD  [STM-SOIC-20_M]  (value not drawn)
U1  SN74HC14PWT  [PW0014A_M]  (value not drawn)  (parts A,B of 7)

### Ports
LMTSW_L (out, see Top_Sheet[1B], Debug[3B], Nucleo[4B]), LMTSW_R (out, see Top_Sheet[1B], Debug[3B], Nucleo[4B]), SERVO (in, see Top_Sheet[1B], Debug[3B], Nucleo[4C]), STPR_A (in, see Top_Sheet[1B], Debug[3B], Nucleo[2C]), STPR_A/ (in, see Top_Sheet[1B], Debug[3B], Nucleo[2C]), STPR_B (in, see Top_Sheet[1B], Debug[3B], Nucleo[1C]), STPR_B/ (in, see Top_Sheet[1B], Debug[3B], Nucleo[1C])

### Nets
+3V3: R10.2 R12.2
+5V: C6.1 P2.11 R9.2 STPR.20(VSS)
+12V: C7.1 STPR.10(VS)
GND: C6.2 C7.2 C8.2 C9.2 P2.1 P2.5 P2.13 STPR.4(GND) STPR.5(GND) STPR.6(GND) STPR.7(GND) STPR.14(GND) STPR.15(GND) STPR.16(GND) STPR.17(GND)
LMTSW_L: U1.2(~{1Y}) ; port LMTSW_L
LMTSW_L_PWR: C8.1 R11.1 U1.1(1A)
LMTSW_L_SIG: P2.7 R10.1 R11.2
LMTSW_R: U1.4(~{2Y}) ; port LMTSW_R
LMTSW_R_PWR: C9.1 R13.1 U1.3(2A)
LMTSW_R_SIG: P2.3 R12.1 R13.2
SERVO: R14.1 ; port SERVO
SERVO_SIG: P2.9 R14.2
STPR_A: STPR.2(INPUT1) ; port STPR_A
STPR_A+: P2.14 STPR.3(OUTPUT1)
STPR_A-: P2.12 STPR.8(OUTPUT2)
STPR_A/: STPR.9(INPUT2) ; port STPR_A/
STPR_B: STPR.12(INPUT3) ; port STPR_B
STPR_B+: P2.10 STPR.13(OUTPUT3)
STPR_B-: P2.8 STPR.18(OUTPUT4)
STPR_B/: STPR.19(INPUT4) ; port STPR_B/
STPR_EN: R9.1 STPR.1(ENABLE1) STPR.11(ENABLE2)

Not connected (* = marked no-connect by the designer): P2 2* 4* 6*

### Notes on the sheet
- Stepper, Limit Switch, Servo
- Stepper Motor
- To Stepper Motors
- Stepper, Limit Switch & Servo Interface
- From MCU
- Limit Switches
- Servo
- To Servo
- From Limit Switches
- To MCU
- Stepper, Limit Swtich, Servo
- 1.3
- Noah Grant

### Library data of the parts
C6 = CMP-03422-000468-1: CAP CER 0.1UF 50V X7R 0603; Manufacturer: YAGEO; Manufacturer Part Number: CC0603KPX7R9BB104; Temperature Coefficient: 15%; Capacitance: 100 nF; Description: CC0603 100 nF X7R 10.00% 50 V; Material: Ceramic; Value: 100 nF; Tolerance: 0.1; Device Class L1: Passive Components; Temperature Range High: +125°C; ComponentLink2Description: Datasheet; Temperature Characteristic: X7R; Octopart: https://octopart.com/cc0603kpx7r9bb104-yageo-12885113; Height: 0.9mm; Mouser Description: Multilayer Ceramic Capacitors MLCC - SMD/SMT 100nF 50V X7R 10%; Device Class L3: Ceramic Capacitors; Voltage Rating: 50 V; Device Class L2: Capacitors; ComponentLink2URL: http://www.yageo.com/documents/recent/UPY-GPHC_X7R_6.3V-to-50V_18.pdf; Package: CC0603-DA; Automotive: No; Voltage: 50 V; RoHS: TRUE; Lead Free: Yes; Digikey Description: CAP CER 0.1UF 50V X7R 0603; Footprint Url: http://www.yageo.com/exep/pages/download/literatures/UPY-C_GEN_24.pdf; Temperature Range Low: -55°C; Temperature: -55°C to +125°C; Category: Cap
C7 = CMP-08246-006763-1: as C2 on sheet DCMTR_ENC; Dielectric: X6S; Capacitance: 1uF; Construction: Flat; Case/Package: 0603; Tolerance: 10%; Dielectric Material: Ceramic; Lead Free: Lead Free; Series: C; Case Code (Metric): 1608; Width: 0.031inch; Weight: 7.1E-05oz; Voltage Rating: 25V; Depth: 0.8mm; Packaging: Tape and Reel; Termination: SMD/SMT; Voltage Rating (DC): 25V; Mount: Surface Mount; Height: 0.8mm; Max Operating Temperature: 105°C; Min Operating Temperature: -55°C; Case Code (Imperial): 0603; Package Quantity: 4000; Length: 1.6mm; Thickness: 0.035inch; RoHS Compliant: Yes
C8 C9 = CMP-2000-05447-3: None; Tolerance: 10%; Voltage Rating: 50V; Dielectric: X5R; Height: 0.8mm; Depth: 0.8mm; Number of Pins: 2; Length: 1.6mm; Thickness: 0.035inch; Contact Plating: Nickel; Radiation Hardening: No; Package Quantity: 1; Case/Package: 0603; Capacitance: 1uF; Halogen Free: Halogen Free; RoHS Compliant: Yes; Termination: SMD/SMT; Max Operating Temperature: 85°C; Min Operating Temperature: -55°C; Case Code (Metric): 1608; Construction: Flat; Voltage Rating (DC): 50V; Packaging: Tape and Reel; Series: M; Case Code (Imperial): 0603; Width: 0.031inch; Mount: Surface Mount
P2 = CMP-1024-00406-1: 0.025" SQ Post Header, Through-hole, Vertical, -55 to 125 degC, 2.54 mm Pitch, 14-Pin, Male, RoHS; Manufacturer: Samtec; Pitch: 2.54 mm; RoHS: True; PackageVersion: DM, 8/1988; Mounting Technology: Through-hole; ComponentLink1Description: Manufacturer URL; Orientation: Vertical; PartNumber: TSW-107-06-L-D; Temperature Range: -55 to 125 degC; ComponentLink3URL: http://www.samtec.com/documents/webfiles/cpdf/TSW-XXX-XX-XXX-X-XX-XXX-MKT.pdf; PackageDescription: .025[0.64] SQ. Post Terminal Strip Assembly; PackageReference: TSW-107-06-X-D; ComponentLink2Description: Datasheet; ComponentLink3Description: Package Specification; ComponentLink1URL: http://www.samtec.com; DatasheetVersion: F-214; ComponentLink2URL: http://www.samtec.com/documents/webfiles/pdf/TSW_TH.PDF
R9 R10 R12 R14 = CMP-1666-00005-4: Chip Resistor, 10 KOhm, +/- 1%, 100 mW, -55 to 155 degC, 0603 (1608 Metric), RoHS, Tape and Reel; Manufacturer: Vishay Semiconductor; Voltage Rating: 75 V; Max Operating Temperature: 155 degC; PackageDescription: 2-Pin Surface Mount Device, Body 1.575 x 0.85 mm; ComponentLink1Description: Manufacturer URL; RoHSCompliant: true; PackageReference: 0603; REACH SVHC: Unknown; Length: 1.55 mm; DatasheetVersion: 06/2012; Packaging: Tape and Reel; Min Operating Temperature: -55 degC; Mounting Technology: Surface Mount; ComponentLink2URL: https://datasheet.ciiva.com/11809/0900766b80d98afc-11809037.pdf; Height: 0.45 mm; ComponentLink2Description: Datasheet; Package Quantity: 5000; ComponentLink1URL: http://www.vishay.com/
R11 R13 = CMP-2000-03824-5: as R5 on sheet DCMTR_ENC; ComponentLink2URL: http://www.vishay.com/docs/20035/dcrcwe3.pdf; ComponentLink1URL: http://www.vishay.com/; Mounting Technology: Surface Mount; ComponentLink1Description: Manufacturer URL; ComponentLink2Description: Datasheet; PackageDescription: 2-Pin Surface Mount Device, Body 1.575 x 0.85 mm; PackageReference: 0603; DatasheetVersion: 06/2012
STPR = CMP-1771-00003-1: as DC_MTR on sheet DCMTR_ENC; REACH SVHC: Unknown; Case Code (Imperial): 0603; ComponentLink2Description: Datasheet; ComponentLink2URL: http://www.st.com/content/ccc/resource/technical/document/datasheet/04/ac/22/f9/20/5d/43/a1/CD00000059.pdf/files/CD00000059.pdf/jcr:content/translations/en.CD00000059.pdf; Max Operating Temperature: 155 degC; Width: 0.8 mm; ComponentLink1URL: http://www.st.com/; ComponentLink1Description: Manufacturer URL; Length: 1.6 mm; Package Quantity: 5000; RoHSCompliant: true; Height: 0.45 mm; Mount: Surface Mount; PackageDescription: 20-Pin Small Outline Integrated Circuit, Body 12.8 x 7.5 mm, Pitch 1.27 mm; PackageReference: SOIC-20; Packaging: Tape and Reel; Min Operating Temperature: -55 degC; Case Code (Metric): 1608; DatasheetVersion: Jul-03
U1 = CMP-1615-00108-4: as U1 on sheet DCMTR_ENC; Operating Temperature Range(C): -40 to 85; Output Type: CMOS; DatasheetVersion: SCLS085G; Generic Part Number: SN74HC14; VCC(Max)(V): 6; Code_JEDEC: MO-153; PackageReference: PW0014A

## Sheet RS232.SchDoc
size Letter; SheetNumber: 6; SheetTotal: 11
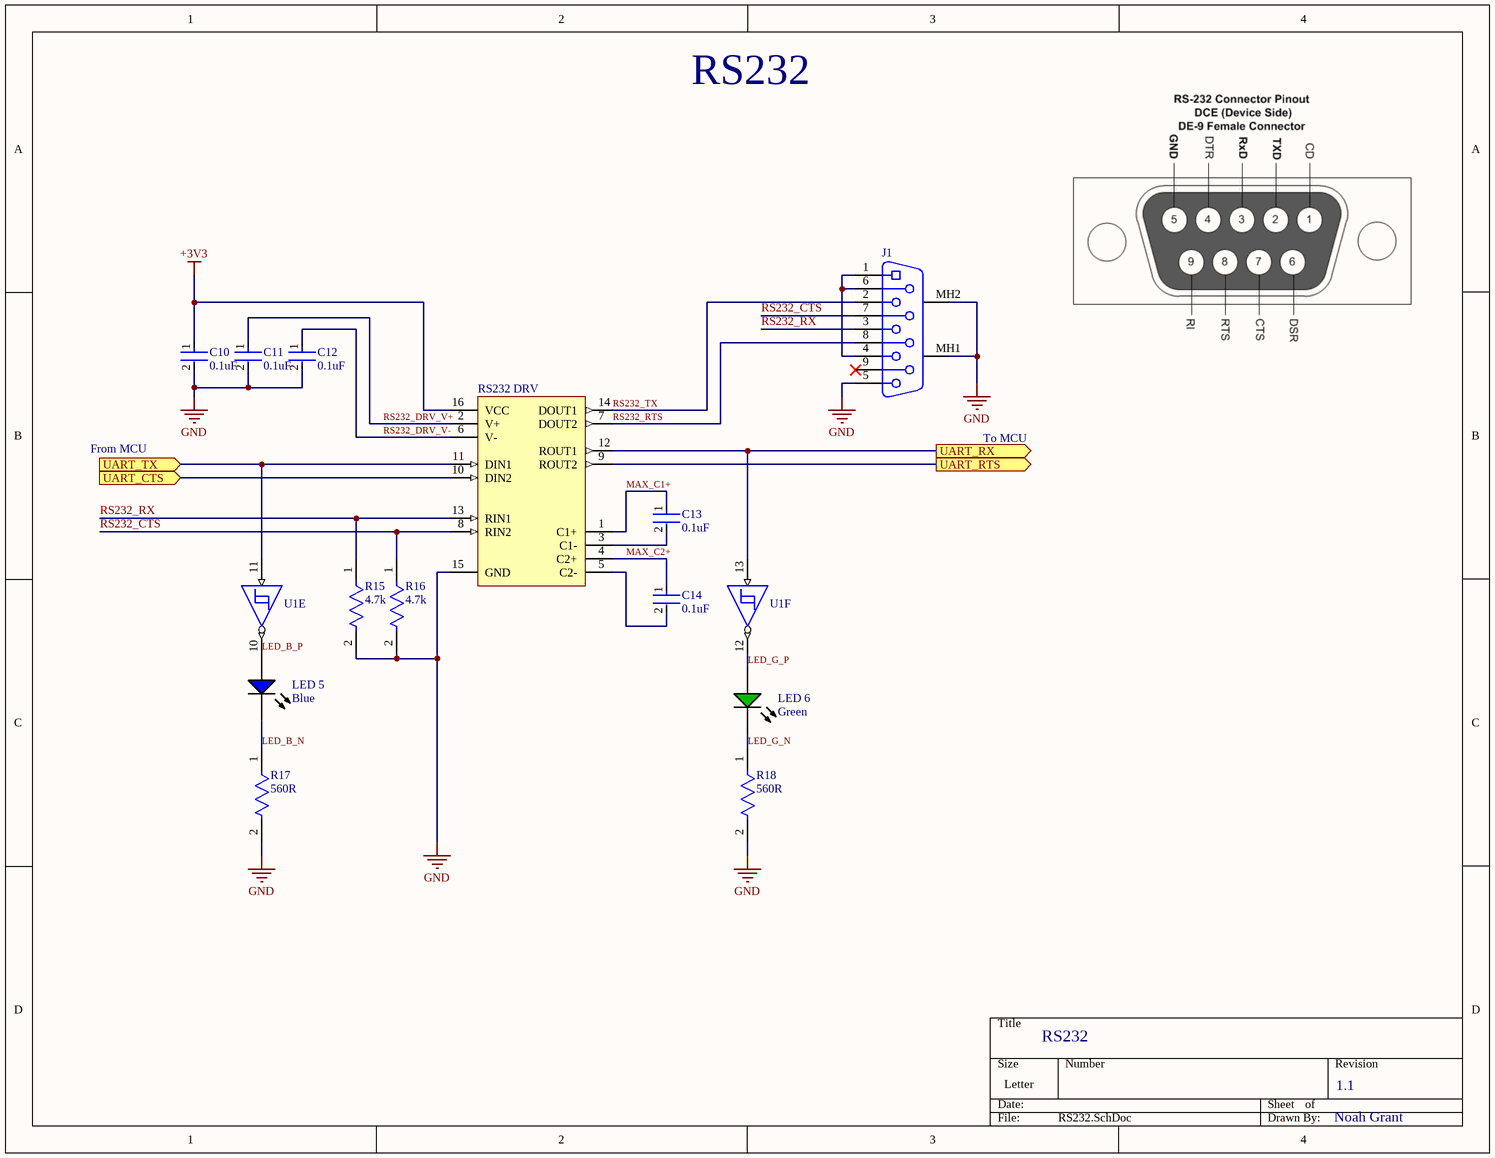
[diagram p4: RS232.SchDoc]

### Parts
C10  0.1uF  [FP-CC0603-DA-MFG]
C11  0.1uF  [FP-CC0603-DA-MFG]
C12  0.1uF  [FP-CC0603-DA-MFG]
C13  0.1uF  [FP-CC0603-DA-MFG]
C14  0.1uF  [FP-CC0603-DA-MFG]
J1  2311765-1  [TECO-2311765-1_V]  (value not drawn)
LED_5  Blue  [AVAG-HSMX-C190_V]
LED_6  Green  [AVAG-HSMX-C190_V]
R15  4.7k  [FP-CRCW0603-e3-IPC_A]
R16  4.7k  [FP-CRCW0603-e3-IPC_A]
R17  560R  [FP-CPF0603-MFG]
R18  560R  [FP-CPF0603-MFG]
RS232_DRV  MAX3232CDR  [D0016A_L]  (value not drawn)
U1  SN74HC14PWT  [PW0014A_M]  (value not drawn)  (parts E,F of 7)

### Ports
UART_CTS (in, see Top_Sheet[4B], Nucleo[4C]), UART_RTS (out, see Top_Sheet[4B], Nucleo[4C]), UART_RX (out, see Top_Sheet[4B], Nucleo[4C]), UART_TX (in, see Top_Sheet[4B], Nucleo[3C])

### Nets
+3V3: C10.1 RS232_DRV.16(VCC)
GND: C10.2 C11.2 C12.2 J1.5 J1.MH1 J1.MH2 R15.2 R16.2 R17.2 R18.2 RS232_DRV.15(GND)
LED_B_N: LED_5.2(K) R17.1
LED_B_P: LED_5.1(A) U1.10(~{5Y})
LED_G_N: LED_6.2(K) R18.1
LED_G_P: LED_6.1(A) U1.12(~{6Y})
MAX_C1+: C13.1 RS232_DRV.1(C1+)
MAX_C2+: C14.1 RS232_DRV.4(C2+)
RS232_CTS: J1.7 R16.1 RS232_DRV.8(RIN2)
RS232_DRV_V+: C11.1 RS232_DRV.2(V+)
RS232_DRV_V-: C12.1 RS232_DRV.6(V-)
RS232_RTS: J1.8 RS232_DRV.7(DOUT2)
RS232_RX: J1.3 R15.1 RS232_DRV.13(RIN1)
RS232_TX: J1.2 RS232_DRV.14(DOUT1)
UART_CTS: RS232_DRV.10(DIN2) ; port UART_CTS
UART_RTS: RS232_DRV.9(ROUT2) ; port UART_RTS
UART_RX: RS232_DRV.12(ROUT1) U1.13(6A) ; port UART_RX
UART_TX: RS232_DRV.11(DIN1) U1.11(5A) ; port UART_TX
NetC13_2: C13.2 RS232_DRV.3(C1-)
NetC14_2: C14.2 RS232_DRV.5(C2-)
NetJ1_1: J1.1 J1.4 J1.6

Not connected (* = marked no-connect by the designer): J1 9*

### Notes on the sheet
- RS232
- From MCU
- To MCU
- 1.1
- Noah Grant

### Library data of the parts
C10-C14 = CMP-03422-000468-1: as C21 on sheet Nucleo; Device Class L1: Passive Components; Temperature Range High: +125°C; ComponentLink2Description: Datasheet; Temperature Characteristic: X7R; Octopart: https://octopart.com/cc0603kpx7r9bb104-yageo-12885113; Height: 0.9mm; Mouser Description: Multilayer Ceramic Capacitors MLCC - SMD/SMT 100nF 50V X7R 10%; Device Class L3: Ceramic Capacitors; Voltage Rating: 50 V; Device Class L2: Capacitors; ComponentLink2URL: http://www.yageo.com/documents/recent/UPY-GPHC_X7R_6.3V-to-50V_18.pdf; Package: CC0603-DA; Automotive: No; Voltage: 50 V; RoHS: TRUE; Lead Free: Yes; Digikey Description: CAP CER 0.1UF 50V X7R 0603; Footprint Url: http://www.yageo.com/exep/pages/download/literatures/UPY-C_GEN_24.pdf; Temperature Range Low: -55°C; Temperature: -55°C to +125°C; Category: Cap
J1 = CMP-2000-07623-1: D-Sub Receptacle, Pitch 2.77 mm, 1 x 9 Position, Height 12.55 mm, -55 to 105 degC, RoHS; Manufacturer: TEConnectivity; Package Description: D-Sub Receptacle, Pitch 2.77 mm, 1 x 9 Position, Height 12.55 mm; Package Reference: 2311765-1; Manufacturer URL: http://www.te.com/; Datasheet URL: http://www.te.com/commerce/DocumentDelivery/DDEController?Action=showdoc&DocId=Customer+Drawing%7F2311765%7FB%7Fpdf%7FEnglish%7FENG_CD_2311765_B.pdf%7F2311765-1; Datasheet Version: Rev. B, 10/2017; Mounting Technology: ThroughHole
LED_5 = CMP-1744-00007-1: LED Uni-Color Blue, 78 mW, 20 mA, -40 to 85 degC, 2-Pin SMD, RoHS, Tape and Reel; Rds On Max: 10 Ohm; Nominal Vgs: -1.7 V; Max Power Dissipation: 360 mW; Elements: 1; Case\Package: TO-236-3; Input Capacitance: 73 pF; Typical Rise Time: 6.3 ns; Nominal Dual Supply Voltage: -50 V; Packaging: Tape and Reel; Height: 0.93 mm; Mount: Surface Mount; RoHSCompliant: true; DatasheetVersion: Apr-10; REACH SVHC: No SVHC; ComponentLink1URL: http://www.avagotech.com/; Radiation Hardening: No; ComponentLink3Description: Package Specification; ComponentLink3URL: http://www.fairchildsemi.com/dwg/MA/MA03D.pdf; ComponentLink2Description: Datasheet; PackageDescription: 2-Pin Surface Mount Device, Body 1.6 x 0.8 mm, Height 0.9 mm; Package Quantity: 3000; PackageReference: HSMX-C190; ComponentLink1Description: Manufacturer URL; Pins: 3; Length: 2.92 mm; ComponentLink2URL: http://docs.avagotech.com/docs/AV02-0977EN; Min Operating Temperature: -55 degC; Width: 1.3 mm; Max Operating Temperature: 150 degC
LED_6 = CMP-1744-00002-1: Chip LED, Green, 2.2 V, -40 to 85 degC, 2-Pin SMD, RoHS, Tape and Reel; Frequency: 400 KHz; Max Supply Voltage: 5.5 V; Access Time: 3500 ns; Clock Frequency: 100 KHz; Case\Package: SOIC; Density: 32 kb; Nominal Supply Current: 2 mA; Interface: Serial; Min Supply Voltage: 1.7 V; Packaging: Tape and Reel; PackageReference: HSMX-C190; ComponentLink2URL: http://docs.avagotech.com/docs/AV02-0551EN; RoHSCompliant: true; Pins: 8; REACH SVHC: No SVHC; Max Operating Temperature: 85 degC; Width: 4 mm; Radiation Hardening: No; Package Quantity: 3000; ComponentLink3Description: Package Specification; ComponentLink1Description: Manufacturer URL; Min Operating Temperature: -40 degC; PackageDescription: 2-Pin Surface Mount Device, Body 1.6 x 0.8 mm, Height 0.9 mm; Max Clock Frequency: 100 KHz; Height: 1.5 mm; ComponentLink1URL: http://www.avagotech.com/; DatasheetVersion: Mar-12; ComponentLink2Description: Datasheet; Mount: Surface Mount; Length: 5 mm; ComponentLink3URL: http://www.fairchildsemi.com/dwg/MA/MA03D.pdf
R15 R16 = CMP-1666-00019-3: as R6 on sheet DCMTR_ENC; Case Code (Metric): 1608; Military Standard: Not; Packaging: Tape and Reel; Termination: SMD/SMT; Temperature Coefficient: 100ppm/°C; Lead Free: Lead Free; Length: 1.55mm; Width: 0.85mm; Height: 0.45mm; Depth: 0.85mm; Weight: 7.1E-05oz; Case Code (Imperial): 0603; Contact Plating: Tin; Case/Package: 0603; Max Operating Temperature: 155°C; Mount: Surface Mount; Tolerance: 1%; Min Operating Temperature: -55°C; Package Quantity: 5000; Voltage Rating (DC): 75V; Composition: Thick Film
R17 R18 = CMP-03211-007342-1: RES SMD 560Ω 0.1% 1/16W 0603; Manufacturer Part Number: CPF0603B560RE1; Manufacturer: TE Connectivity; Temperature Coefficient: 25ppm/°C; Voltage Rating: 50V; Power Rating: 0.063W; Lead Free: Yes; Automotive: No; Octopart: https://octopart.com/cpf0603b560re1-te+connectivity-9539416; Temperature Range High: +155°C; Device Class L2: Resistors; Temperature Range Low: -55°C; Composition: Thin Film; RoHS: TRUE; ComponentLink2URL: https://www.te.com/commerce/DocumentDelivery/DDEController?Action=showdoc&DocId=Data+Sheet%7F1773200%7FM%7Fpdf%7FEnglish%7FENG_DS_1773200_M.pdf%7F3-1676481-2; Temperature: -55°C to +155°C; Device Class L1: Passive Components; Resistance: 560Ω; Height: 0.55mm; Series: CPF; octopart_url: https://octopart.com/cpf0603b560re1-te+connectivity-9539416; Category: Res; Tolerance: 0.1%; ComponentLink2Description: Datasheet; packaging: 1k Reel; Package: CPF0603; Device Class L3: Chip SMD Resistors; Value: 560Ω; Ipc Land Pattern Name: RESC15580X45
RS232_DRV = CMP-0299-00399-2: 3-V to 5.5-V Multichannel RS-232 Line Driver / Receiver with ±15-kV ESD Protection, 0 to 70 degC, 16-Pin SOIC (D), Green (RoHS & no Sb/Br); Receivers Per Package: 2; ESD HBM(kV): +/-15; ICC(Max)(mA): 1; Supply Voltage(s)(V): 3.3 or 5.0; Single Supply: TRUE; ComponentLink1URL: www.ti.com; ComponentLink3URL: http://www.ti.com/litv/pdf/mpds178g; PackageReference: D0016A; ComponentLink2Description: Datasheet; ComponentLink2URL: http://www.ti.com/general/docs/lit/getliterature.tsp?genericPartNumber=MAX3232&fileType=pdf; ComponentLink1Description: Manufacturer URL; PackageDescription: 16-Pin Plastic Small Outline Integrated Circuit, 9.9 x 3.9 mm, Pitch 1.27 mm Pitch; PackageVersion: revM, Jun-2011; Drivers Per Package: 2; SubFamily: RS-232; DatasheetVersion: SLLS410I; ComponentLink3Description: Package Specification; RS-232: TRUE
U1 = CMP-1615-00108-4: as U1 on sheet DCMTR_ENC; Operating Temperature Range(C): -40 to 85; Output Type: CMOS; DatasheetVersion: SCLS085G; Generic Part Number: SN74HC14; VCC(Max)(V): 6; Code_JEDEC: MO-153; PackageReference: PW0014A

## Sheet CAN_DAC.SchDoc
size Letter; SheetNumber: 7; SheetTotal: 11
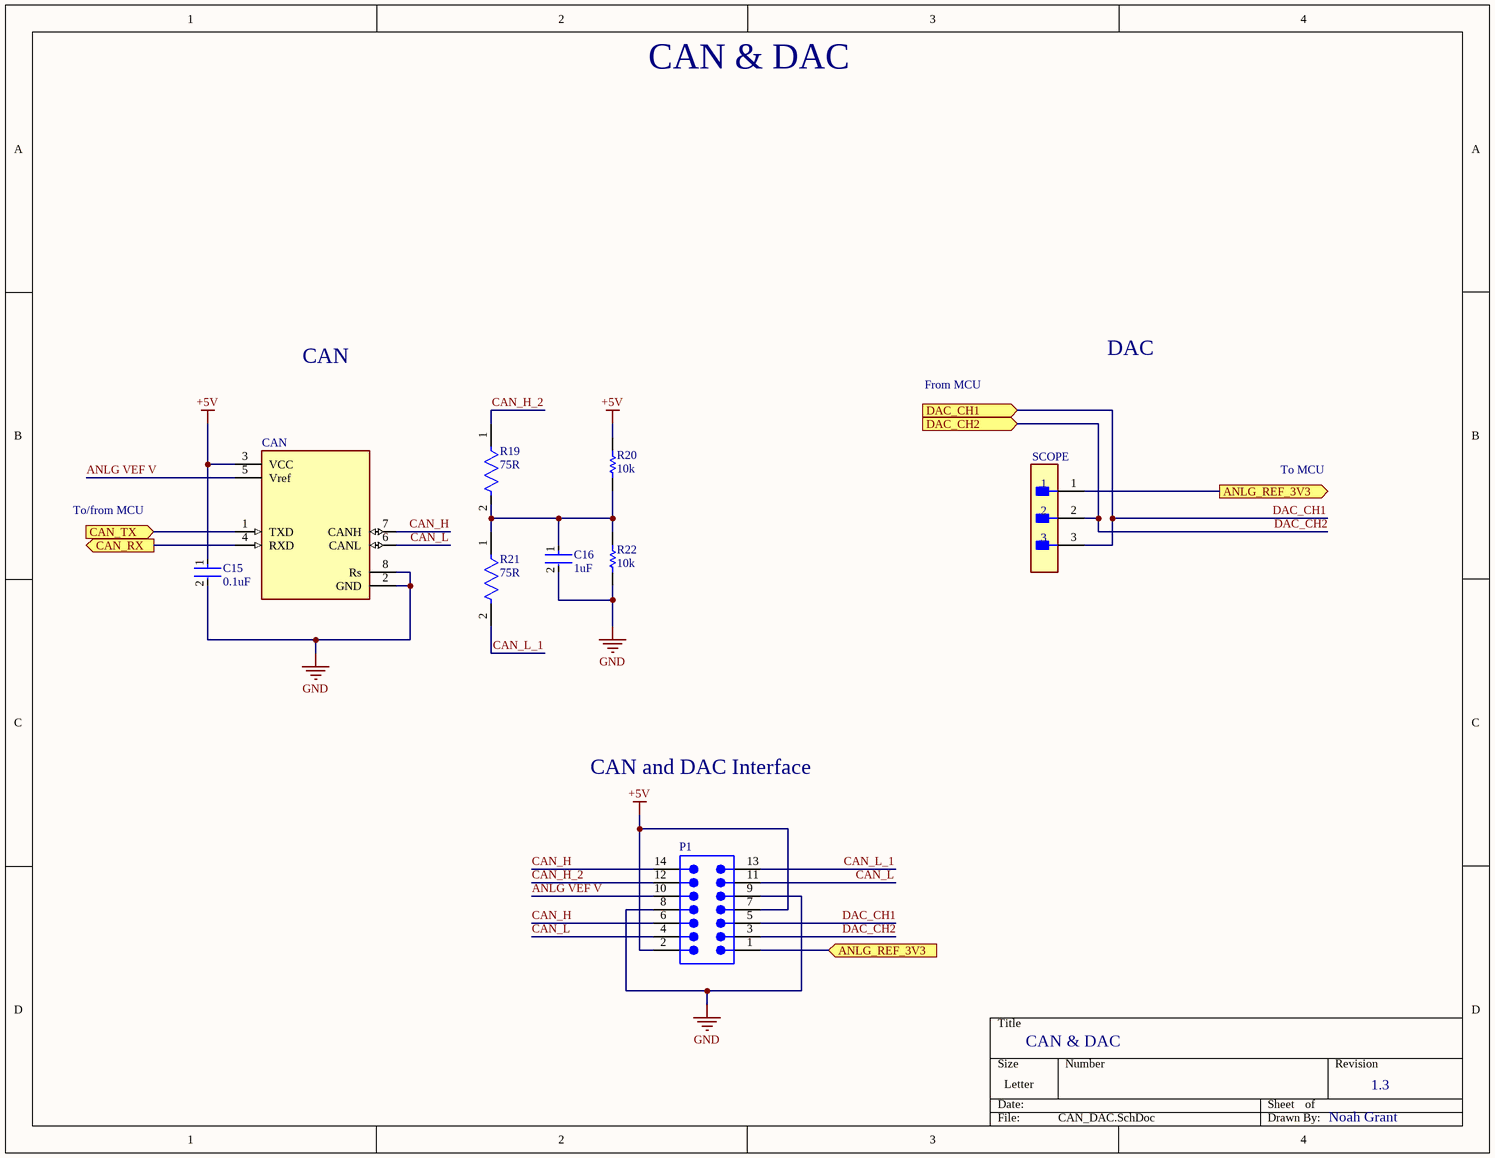
[diagram p5: CAN_DAC.SchDoc]

### Parts
C15  0.1uF  [FP-CC0603-DA-MFG]
C16  1uF  [FP-C0603C105K3PACTU-MFG]
CAN  PCA82C250T/YM,115  [FP-PCA82C250T-YM_115-MFG]  (value not drawn)
P1  TSW-107-06-L-D  [SMTC-TSW-107-06-X-D]  (value not drawn)
R19  75R  [FP-RT0603-MFG]
R20  10k  [RESC1609X50X30NL8T20]
R21  75R  [FP-RT0603-MFG]
R22  10k  [RESC1609X50X30NL8T20]
SCOPE  22-29-2031  [FP-22-29-2031-MFG]  (value not drawn)

### Ports
ANLG_REF_3V3 (in, see Top_Sheet[4B], Nucleo[3B]), ANLG_REF_3V3 (out, see Top_Sheet[4B], Nucleo[3B]), CAN_RX (out, see Top_Sheet[4B], Nucleo[3B]), CAN_TX (in, see Top_Sheet[4B], Nucleo[3B]), DAC_CH1 (in, see Top_Sheet[4B], Nucleo[2C]), DAC_CH2 (in, see Top_Sheet[4B], Nucleo[3C])

### Nets
+5V: C15.1 CAN.3(VCC) P1.2 P1.7 R20.2
GND: C15.2 C16.2 CAN.2(GND) CAN.8(Rs) P1.8 P1.9 R22.1
ANLG VEF V: CAN.5(Vref) P1.10
ANLG_REF_3V3: P1.1 SCOPE.1 ; port ANLG_REF_3V3
CAN_H: CAN.7(CANH) P1.6 P1.14
CAN_H_2: P1.12 R19.1
CAN_L: CAN.6(CANL) P1.4 P1.11
CAN_L_1: P1.13 R21.2
CAN_RX: CAN.4(RXD) ; port CAN_RX
CAN_TX: CAN.1(TXD) ; port CAN_TX
DAC_CH1: P1.5 SCOPE.3 ; port DAC_CH1
DAC_CH2: P1.3 SCOPE.2 ; port DAC_CH2
NetC16_1: C16.1 R19.2 R20.1 R21.1 R22.2

### Notes on the sheet
- CAN & DAC
- CAN
- DAC
- From MCU
- To MCU
- To/from MCU
- CAN and DAC Interface
- 1.3
- Noah Grant

### Library data of the parts
C15 = CMP-03422-000468-1: as C6 on sheet STPR_LMTSW_SRV; Device Class L1: Passive Components; Temperature Range High: +125°C; ComponentLink2Description: Datasheet; Temperature Characteristic: X7R; Octopart: https://octopart.com/cc0603kpx7r9bb104-yageo-12885113; Height: 0.9mm; Mouser Description: Multilayer Ceramic Capacitors MLCC - SMD/SMT 100nF 50V X7R 10%; Device Class L3: Ceramic Capacitors; Voltage Rating: 50 V; Device Class L2: Capacitors; ComponentLink2URL: http://www.yageo.com/documents/recent/UPY-GPHC_X7R_6.3V-to-50V_18.pdf; Package: CC0603-DA; Automotive: No; Voltage: 50 V; RoHS: TRUE; Lead Free: Yes; Digikey Description: CAP CER 0.1UF 50V X7R 0603; Footprint Url: http://www.yageo.com/exep/pages/download/literatures/UPY-C_GEN_24.pdf; Temperature Range Low: -55°C; Temperature: -55°C to +125°C; Category: Cap
C16 = CMP-2006-02216-3: CAP CER 1UF 25V X5R 0603; Dielectric Material: Ceramic; Tolerance: 10%; Contact Plating: Tin; Number of Pins: 2; Lead Free: Lead Free; Depth: 0.8mm; Length: 1.6mm; Mount: Surface Mount; Case Code (Metric): 1608; Max Operating Temperature: 85°C; Voltage: 25V; Voltage Rating (DC): 25V; REACH SVHC: No SVHC; Height: 0.8mm; Series: C0603C; Case/Package: 0603; Case Code (Imperial): 0603; Capacitance: 1uF; RoHS Compliant: Yes; Dielectric: X5R; Packaging: Tape and Reel; Construction: Flat; Thickness: 0.034inch; Voltage Rating: 25V; Radiation Hardening: No; Width: 0.031inch; Min Operating Temperature: -55°C; Termination: SMD/SMT; Package Quantity: 4000
CAN = CMP-10098-000006-1: IC TRANSCEIVER HALF 1/1 8SO; Manufacturer: NXP Semiconductors; Interface: CAN; Min Supply Voltage: 4.5V; Nominal Supply Current: 14-70mA; Max Supply Voltage: 5.5V; Standoff Height: 0.1mm; Max Junction Temp: +150°C; ComponentLink2URL: https://www.nxp.com/docs/en/data-sheet/PCA82C250.pdf; Temperature Range High: +150°C; Mouser Description: CAN Interface IC CAN CONTROLLER INTERFACE; Ipc Land Pattern Name: SOIC127P600X175-8; Device Class L3: unset; Octopart: https://octopart.com/pca82c250t%2Fym%2C115-nxp+semiconductors-18837169; Lead Free: Yes; ComponentLink2Description: Datasheet; Device Class L1: Integrated Circuits (ICs); Ambient Temperature Range High: +125°C; Package: SOIC8; Digikey Description: IC TRANSCEIVER HALF 1/1 8SO; RoHS: TRUE; Automotive: No; Temperature Range Low: -40°C; Manufacturer Part Number: PCA82C250T/YM,115; Device Class L2: Interface ICs; Ambient Temperature Range Low: -40°C; Temperature: -40°C to +150°C; Category: IC; Footprint Url: https://www.nxp.com/docs/en/package-information/SOT96-1.pdf; Height: 1.75mm
P1 = CMP-1024-00406-1: as P2 on sheet STPR_LMTSW_SRV; RoHS: True; PackageVersion: DM, 8/1988; Mounting Technology: Through-hole; ComponentLink1Description: Manufacturer URL; Orientation: Vertical; PartNumber: TSW-107-06-L-D; Temperature Range: -55 to 125 degC; ComponentLink3URL: http://www.samtec.com/documents/webfiles/cpdf/TSW-XXX-XX-XXX-X-XX-XXX-MKT.pdf; PackageDescription: .025[0.64] SQ. Post Terminal Strip Assembly; PackageReference: TSW-107-06-X-D; ComponentLink2Description: Datasheet; ComponentLink3Description: Package Specification; ComponentLink1URL: http://www.samtec.com; DatasheetVersion: F-214; ComponentLink2URL: http://www.samtec.com/documents/webfiles/pdf/TSW_TH.PDF
R19 R21 = CMP-2000-04797-2: RES SMD 75 OHM 1% 1/10W 0603; Manufacturer: Yageo; Manufacturer Part Number: RT0603FRE0775RL; Resistance: 75Ω; Voltage Rating: 75V; Tolerance: 0.01; Value: 75Ω; Power Rating: 0.1W; Temperature Coefficient: 50 ppm/°C; Ipc Land Pattern Name: RESC16080X45; Height: 0.55mm; Lead Free: Yes; Mouser Description: Res Thin Film 0603 75 Ohm 1% 1/10W ±50ppm/°C Molded SMD SMD Paper T/R; Device Class L2: Resistors; Device Class L1: Passive Components; Series: RT; Composition: Thin Film; Automotive: No; Footprint Url: http://www.yageo.com/exep/pages/download/literatures/PYu-R_Mount_10.pdf; Temperature: -55°C to +155°C; Temperature Range High: +155°C; Temperature Range Low: -55°C; ComponentLink2URL: http://www.yageo.com/documents/recent/PYu-RT_1-to-0.01_RoHS_L_9.pdf; Device Class L3: Chip SMD Resistors; Octopart: https://octopart.com/rt0603fre0775rl-yageo-1163751; ComponentLink2Description: Datasheet; RoHS: TRUE; Digikey Description: RES SMD 75 OHM 1% 1/10W 0603; Category: Res; Package: RT0603
R20 R22 = CMP-1666-00005-4: as R9 on sheet STPR_LMTSW_SRV; Max Operating Temperature: 155 degC; PackageDescription: 2-Pin Surface Mount Device, Body 1.575 x 0.85 mm; ComponentLink1Description: Manufacturer URL; RoHSCompliant: true; PackageReference: 0603; REACH SVHC: Unknown; Length: 1.55 mm; DatasheetVersion: 06/2012; Packaging: Tape and Reel; Min Operating Temperature: -55 degC; Mounting Technology: Surface Mount; ComponentLink2URL: https://datasheet.ciiva.com/11809/0900766b80d98afc-11809037.pdf; Height: 0.45 mm; ComponentLink2Description: Datasheet; Package Quantity: 5000; ComponentLink1URL: http://www.vishay.com/
SCOPE = CMP-04776-000327-1: CONN HEADER VERT 3POS 2.54MM; Contact Resistance: 10mR; Number of Positions: 3; Voltage Rating: 250V; Gender: Male; Connector Type: Male Pin; Current Rating: 4A; Packaging: Bulk; Housing Material: Nylon; Min Operating Temperature: 0°C; Color: Natural; RoHS Compliant: Yes; Housing Color: White; Number of Rows: 1; Pitch: 2.54mm; Mount: Through Hole; Fastening Type: Friction; Length: 7.62mm; Depth: 5.8mm; Contact Material: Brass; Max Operating Temperature: 75°C; Number of Contacts: 3; Contact Type: Male Pin; Working Voltage: 250V; Orientation: Straight; Lead Pitch: 2.54mm; Radiation Hardening: No; Termination: Solder; Contact Plating: Gold; Contact Mating Length: 0.295inch; Series: KK® 6410